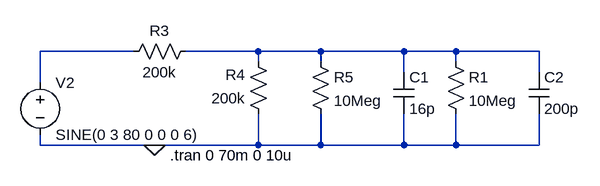
[diagram p0: schematic Exp2part4.asc]
Exp2part4.asc, the LTspice schematic file:
Version 4
SHEET 1 880 680
WIRE -144 -128 -288 -128
WIRE 48 -128 -64 -128
WIRE 144 -128 48 -128
WIRE 272 -128 144 -128
WIRE 352 -128 272 -128
WIRE 480 -128 352 -128
WIRE 48 -112 48 -128
WIRE 144 -112 144 -128
WIRE 352 -112 352 -128
WIRE 272 -96 272 -128
WIRE 480 -96 480 -128
WIRE -288 -80 -288 -128
WIRE -288 16 -288 0
WIRE -112 16 -288 16
WIRE 48 16 48 -32
WIRE 48 16 -112 16
WIRE 144 16 144 -32
WIRE 144 16 48 16
WIRE 272 16 272 -32
WIRE 272 16 144 16
WIRE 352 16 352 -32
WIRE 352 16 272 16
WIRE 480 16 480 -32
WIRE 480 16 352 16
FLAG -112 16 0
SYMBOL voltage -288 -96 R0
WINDOW 123 0 0 Left 0
WINDOW 39 0 0 Left 0
SYMATTR InstName V2
SYMATTR Value SINE(0 3 80 0 0 0 6)
SYMBOL res -48 -144 R90
WINDOW 0 0 56 VBottom 2
WINDOW 3 32 56 VTop 2
SYMATTR InstName R3
SYMATTR Value 200k
SYMBOL res 64 -16 R180
WINDOW 0 36 76 Left 2
WINDOW 3 36 40 Left 2
SYMATTR InstName R4
SYMATTR Value 200k
SYMBOL res 128 -128 R0
SYMATTR InstName R5
SYMATTR Value 10Meg
SYMBOL cap 256 -96 R0
SYMATTR InstName C1
SYMATTR Value 16p
SYMBOL res 336 -128 R0
SYMATTR InstName R1
SYMATTR Value 10Meg
SYMBOL cap 464 -96 R0
SYMATTR InstName C2
SYMATTR Value 200p
TEXT -88 32 Left 2 !.tran 0 70m 0 10u

The netlist it stands for:
* Exp2part4.asc
V2 N001 0 SINE(0 3 80 0 0 0 6)
R3 N002 N001 200k
R4 0 N002 200k
R5 N002 0 10Meg
C1 N002 0 16p
R1 N002 0 10Meg
C2 N002 0 200p
.tran 0 70m 0 10u
.backanno
.end